# EAGLE design LEDs (EAGLE 9.5.2)
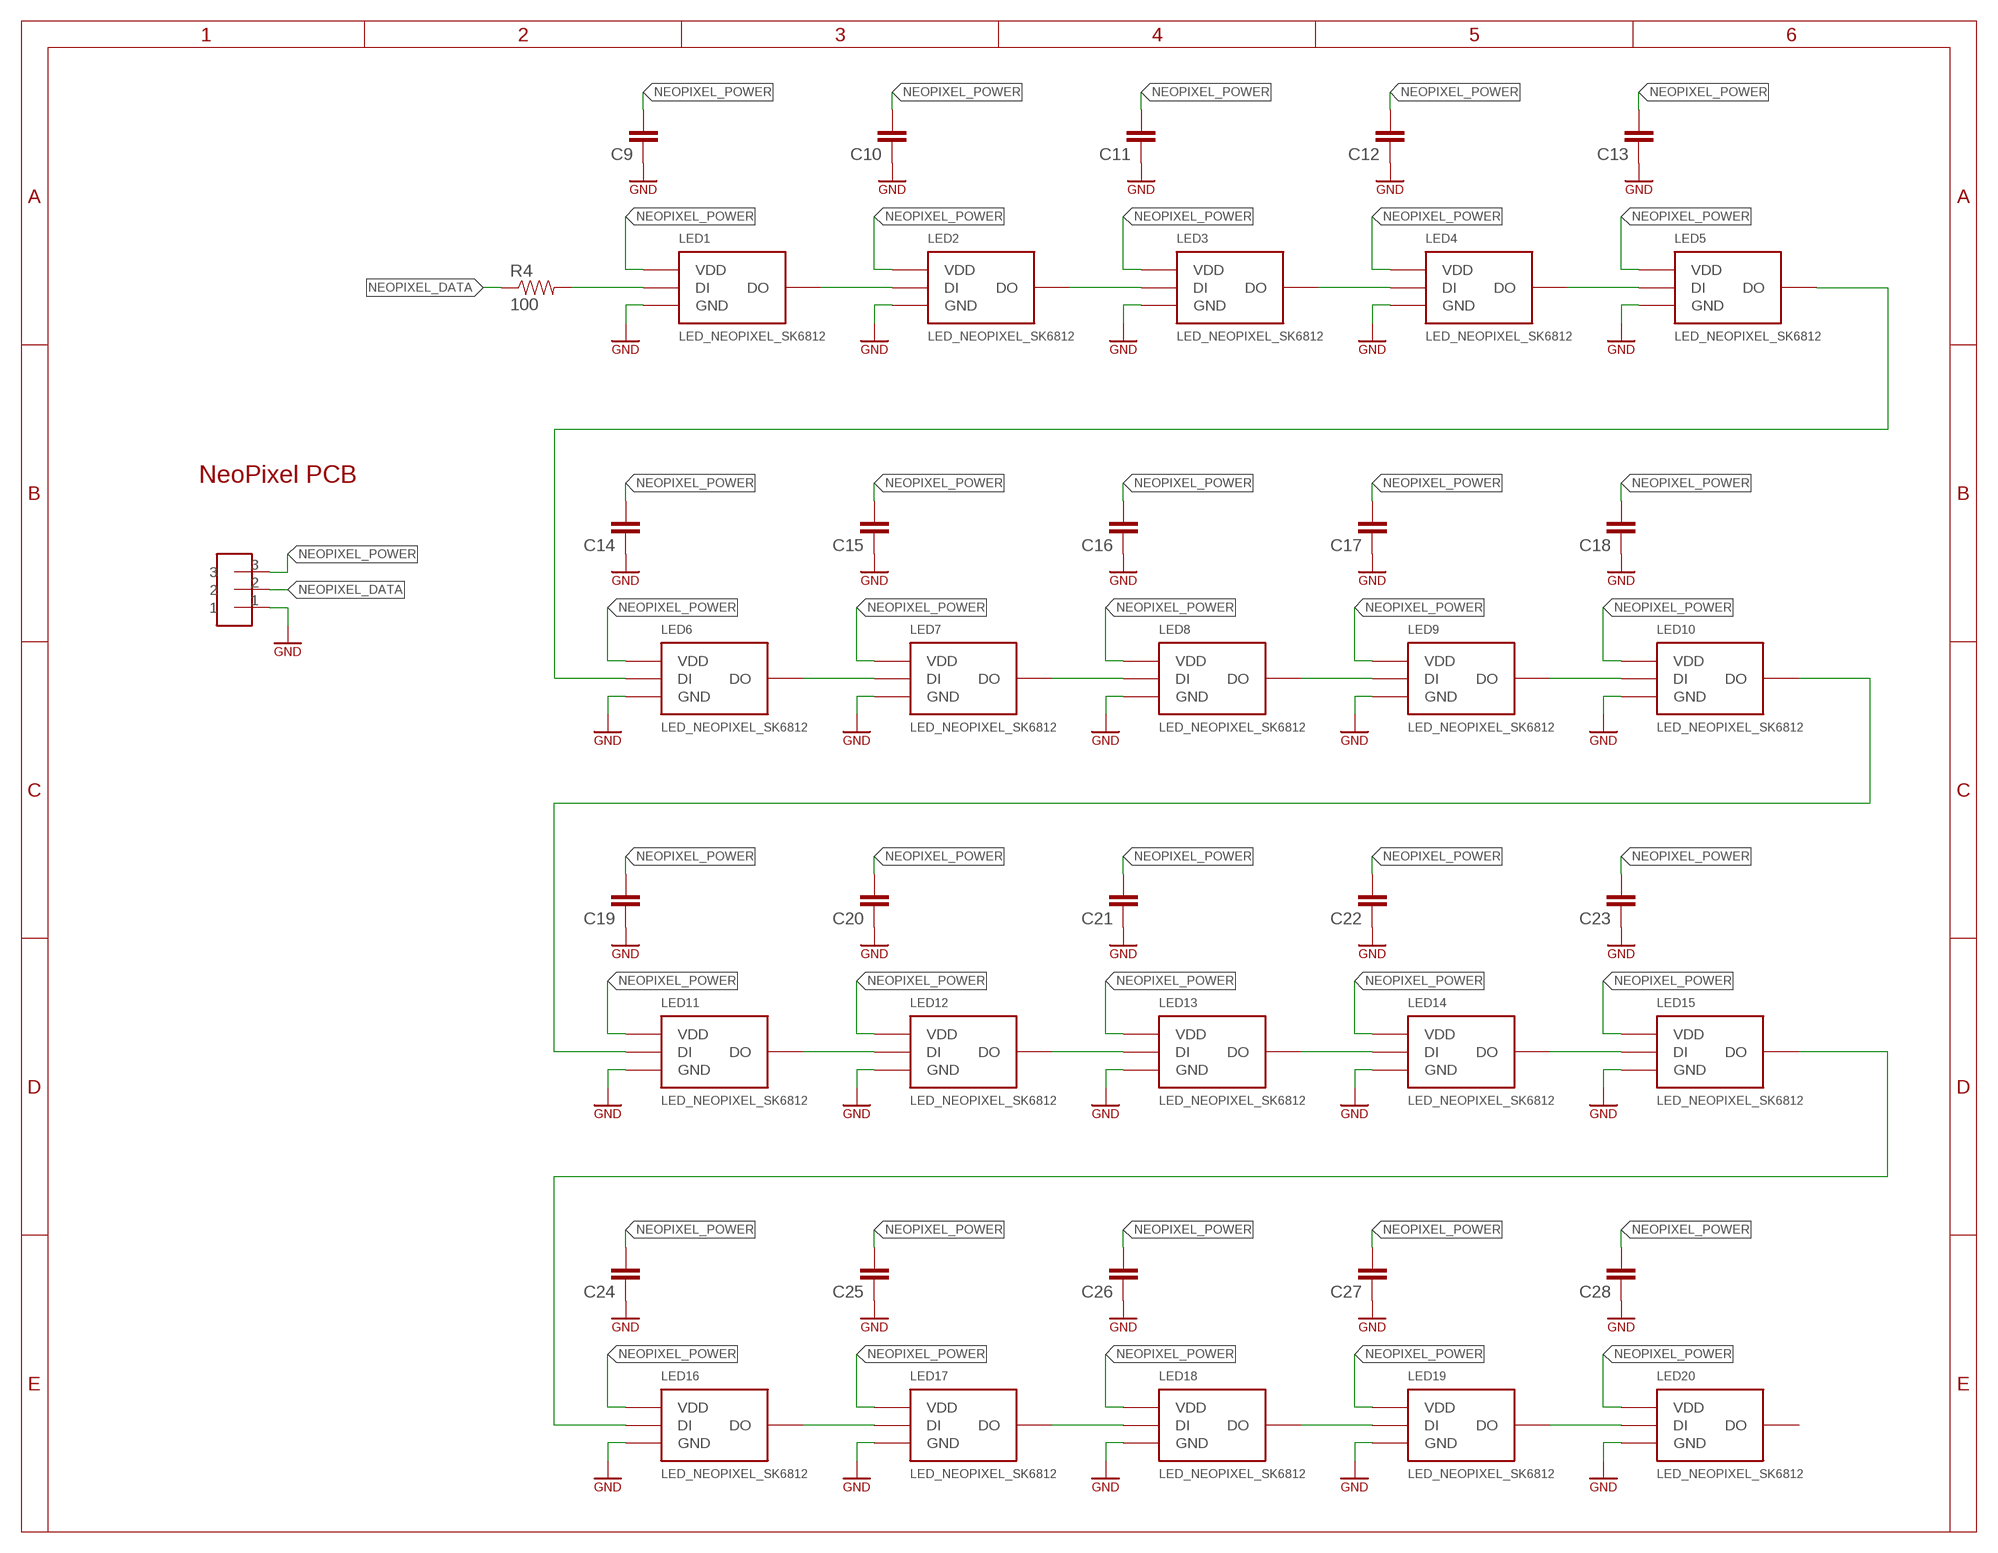
[diagram p0: schematic, sheet 1]

## Parts
C9  COMPONENT_CAP-0805  [0805]
C10  COMPONENT_CAP-0805  [0805]
C11  COMPONENT_CAP-0805  [0805]
C12  COMPONENT_CAP-0805  [0805]
C13  COMPONENT_CAP-0805  [0805]
C14  COMPONENT_CAP-0805  [0805]
C15  COMPONENT_CAP-0805  [0805]
C16  COMPONENT_CAP-0805  [0805]
C17  COMPONENT_CAP-0805  [0805]
C18  COMPONENT_CAP-0805  [0805]
C19  COMPONENT_CAP-0805  [0805]
C20  COMPONENT_CAP-0805  [0805]
C21  COMPONENT_CAP-0805  [0805]
C22  COMPONENT_CAP-0805  [0805]
C23  COMPONENT_CAP-0805  [0805]
C24  COMPONENT_CAP-0805  [0805]
C25  COMPONENT_CAP-0805  [0805]
C26  COMPONENT_CAP-0805  [0805]
C27  COMPONENT_CAP-0805  [0805]
C28  COMPONENT_CAP-0805  [0805]
LED1  LED_NEOPIXEL_SK6812  [SK6812]
LED2  LED_NEOPIXEL_SK6812  [SK6812]
LED3  LED_NEOPIXEL_SK6812  [SK6812]
LED4  LED_NEOPIXEL_SK6812  [SK6812]
LED5  LED_NEOPIXEL_SK6812  [SK6812]
LED6  LED_NEOPIXEL_SK6812  [SK6812]
LED7  LED_NEOPIXEL_SK6812  [SK6812]
LED8  LED_NEOPIXEL_SK6812  [SK6812]
LED9  LED_NEOPIXEL_SK6812  [SK6812]
LED10  LED_NEOPIXEL_SK6812  [SK6812]
LED11  LED_NEOPIXEL_SK6812  [SK6812]
LED12  LED_NEOPIXEL_SK6812  [SK6812]
LED13  LED_NEOPIXEL_SK6812  [SK6812]
LED14  LED_NEOPIXEL_SK6812  [SK6812]
LED15  LED_NEOPIXEL_SK6812  [SK6812]
LED16  LED_NEOPIXEL_SK6812  [SK6812]
LED17  LED_NEOPIXEL_SK6812  [SK6812]
LED18  LED_NEOPIXEL_SK6812  [SK6812]
LED19  LED_NEOPIXEL_SK6812  [SK6812]
LED20  LED_NEOPIXEL_SK6812  [SK6812]
R4  100  COMPONENT_RESISTOR-0805  [0805]
U$2  HEADER-3-HORIZONTAL  [HEADER-3-HORIZONTAL]

## Nets
GND: C9.1 C10.1 C11.1 C12.1 C13.1 C14.1 C15.1 C16.1 C17.1 C18.1 C19.1 C20.1 C21.1 C22.1 C23.1 C24.1 C25.1 C26.1 C27.1 C28.1 LED1.3-GND(GND) LED2.3-GND(GND) LED3.3-GND(GND) LED4.3-GND(GND) LED5.3-GND(GND) LED6.3-GND(GND) LED7.3-GND(GND) LED8.3-GND(GND) LED9.3-GND(GND) LED10.3-GND(GND) LED11.3-GND(GND) LED12.3-GND(GND) LED13.3-GND(GND) LED14.3-GND(GND) LED15.3-GND(GND) LED16.3-GND(GND) LED17.3-GND(GND) LED18.3-GND(GND) LED19.3-GND(GND) LED20.3-GND(GND) U$2.1 ; supply symbol labelled SYMBOL_GND
N$3: LED1.4-DIN(DI) R4.2
N$4: LED1.2-DOUT(DO) LED2.4-DIN(DI)
N$5: LED2.2-DOUT(DO) LED3.4-DIN(DI)
N$6: LED3.2-DOUT(DO) LED4.4-DIN(DI)
N$7: LED4.2-DOUT(DO) LED5.4-DIN(DI)
N$8: LED5.2-DOUT(DO) LED6.4-DIN(DI)
N$9: LED6.2-DOUT(DO) LED7.4-DIN(DI)
N$10: LED7.2-DOUT(DO) LED8.4-DIN(DI)
N$11: LED8.2-DOUT(DO) LED9.4-DIN(DI)
N$12: LED9.2-DOUT(DO) LED10.4-DIN(DI)
N$13: LED10.2-DOUT(DO) LED11.4-DIN(DI)
N$14: LED11.2-DOUT(DO) LED12.4-DIN(DI)
N$15: LED12.2-DOUT(DO) LED13.4-DIN(DI)
N$16: LED13.2-DOUT(DO) LED14.4-DIN(DI)
N$17: LED14.2-DOUT(DO) LED15.4-DIN(DI)
N$18: LED15.2-DOUT(DO) LED16.4-DIN(DI)
N$19: LED16.2-DOUT(DO) LED17.4-DIN(DI)
N$20: LED17.2-DOUT(DO) LED18.4-DIN(DI)
N$21: LED18.2-DOUT(DO) LED19.4-DIN(DI)
N$22: LED19.2-DOUT(DO) LED20.4-DIN(DI)
NEOPIXEL_DATA: R4.1 U$2.2
NEOPIXEL_POWER: C9.2 C10.2 C11.2 C12.2 C13.2 C14.2 C15.2 C16.2 C17.2 C18.2 C19.2 C20.2 C21.2 C22.2 C23.2 C24.2 C25.2 C26.2 C27.2 C28.2 LED1.1-VDD(VDD) LED2.1-VDD(VDD) LED3.1-VDD(VDD) LED4.1-VDD(VDD) LED5.1-VDD(VDD) LED6.1-VDD(VDD) LED7.1-VDD(VDD) LED8.1-VDD(VDD) LED9.1-VDD(VDD) LED10.1-VDD(VDD) LED11.1-VDD(VDD) LED12.1-VDD(VDD) LED13.1-VDD(VDD) LED14.1-VDD(VDD) LED15.1-VDD(VDD) LED16.1-VDD(VDD) LED17.1-VDD(VDD) LED18.1-VDD(VDD) LED19.1-VDD(VDD) LED20.1-VDD(VDD) U$2.3
Unconnected: LED20.2-DOUT(DO)

## Notes on the sheet
- NeoPixel PCB

## Library data of the parts
C9-C28 = homemade-hardware:COMPONENT_CAP: Capacitor Standard 0603 ceramic capacitor, and 0.1" leaded capacitor.
LED1-LED20 = homemade-hardware:LED_NEOPIXEL_SK6812: SK6812 <https://www.digikey.com/product-detail/en/adafruit-industries-llc/1655/1528-1104-ND/5154679>: NeoPixel Addressable LED
R4 = homemade-hardware:COMPONENT_RESISTOR
U$2 = homemade-hardware:HEADER-3: NPTC081KFXC-RC <https://www.digikey.com/product-detail/en/sullins-connector-solutions/NPTC081KFXC-RC/S5600-ND/776058>: Vertical Female SMD Headers TSM-110-01-T-SV <https://www.digikey.com/product-detail/en/samtec-inc/TSM-110-01-T-SV/SAM12267-ND/6691889>: Vertical Male SMD Headers M20-8890845 <https://www.digikey.com/products/en?keywords=952-3236-ND>: Horizontal Male SMD Headers M20-7910842R <https://www.digikey.com/product-detail/en/harwin-inc/M20-7910842R/952-3200-6-ND/6559341>: Horizontal Female SMD Headers

## Board
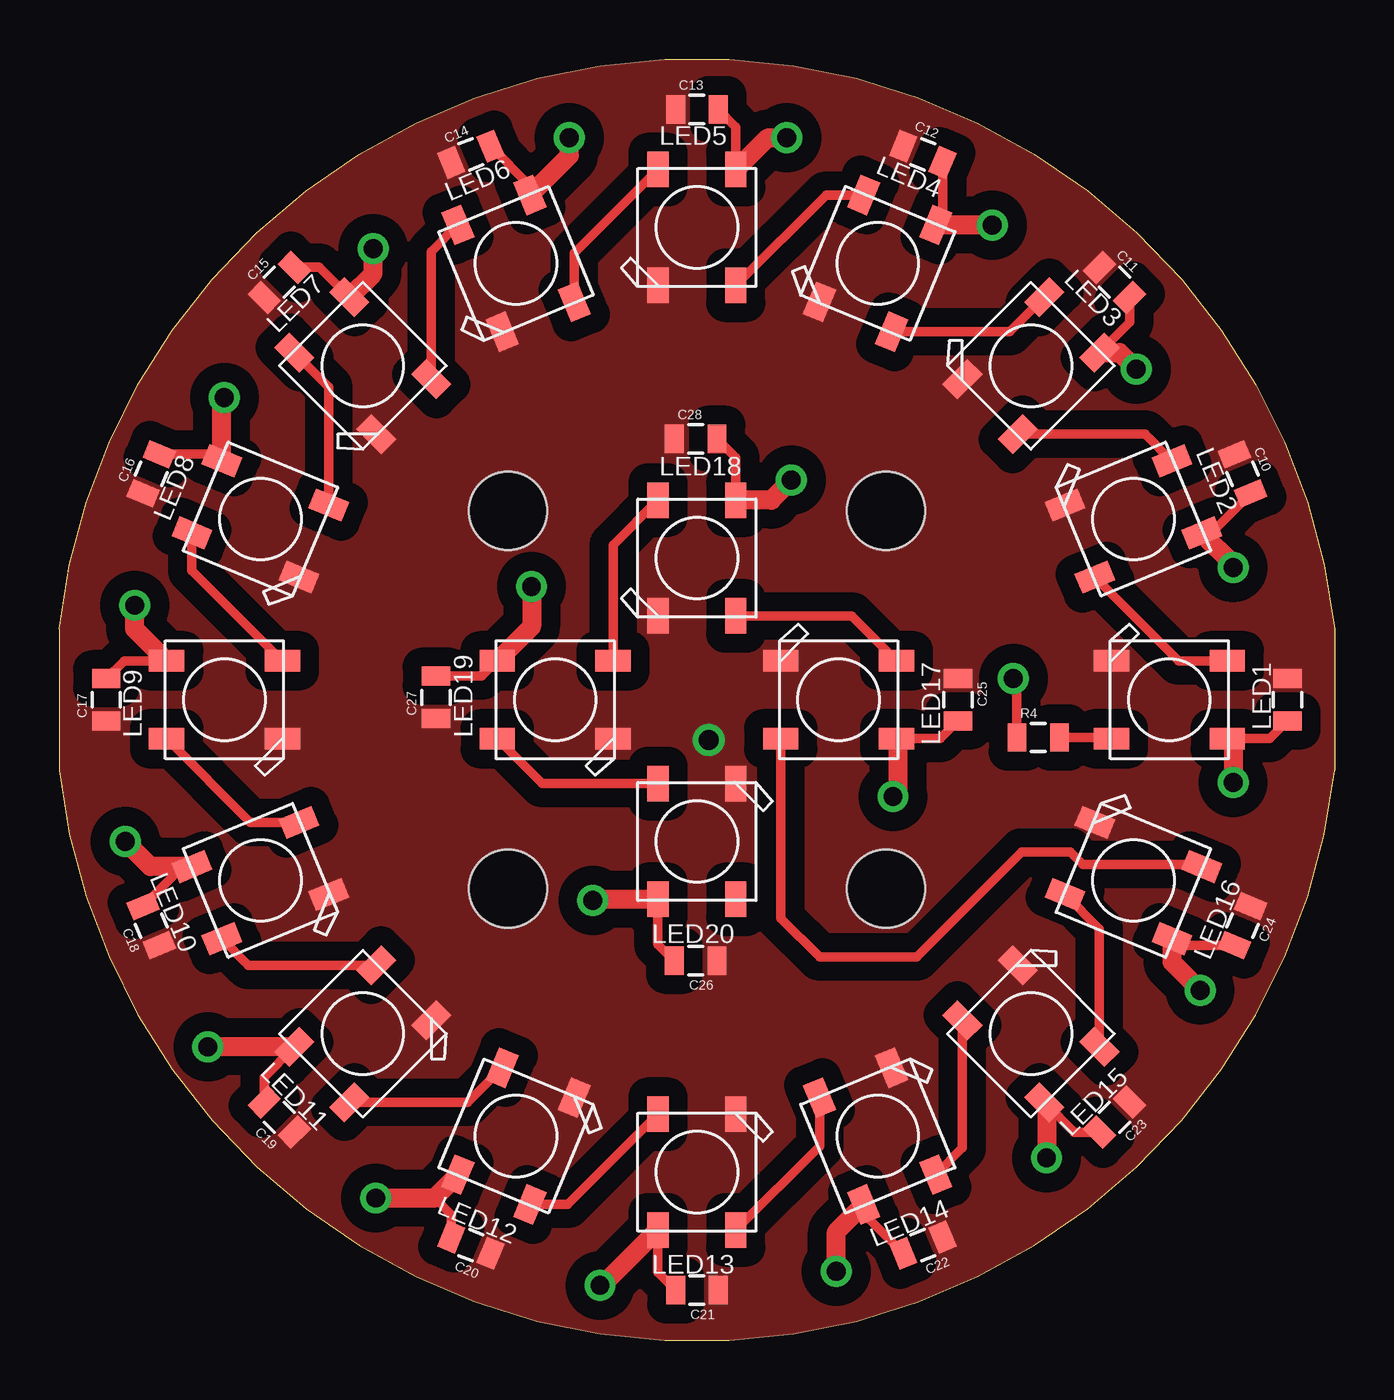
[diagram p1: board, top side]
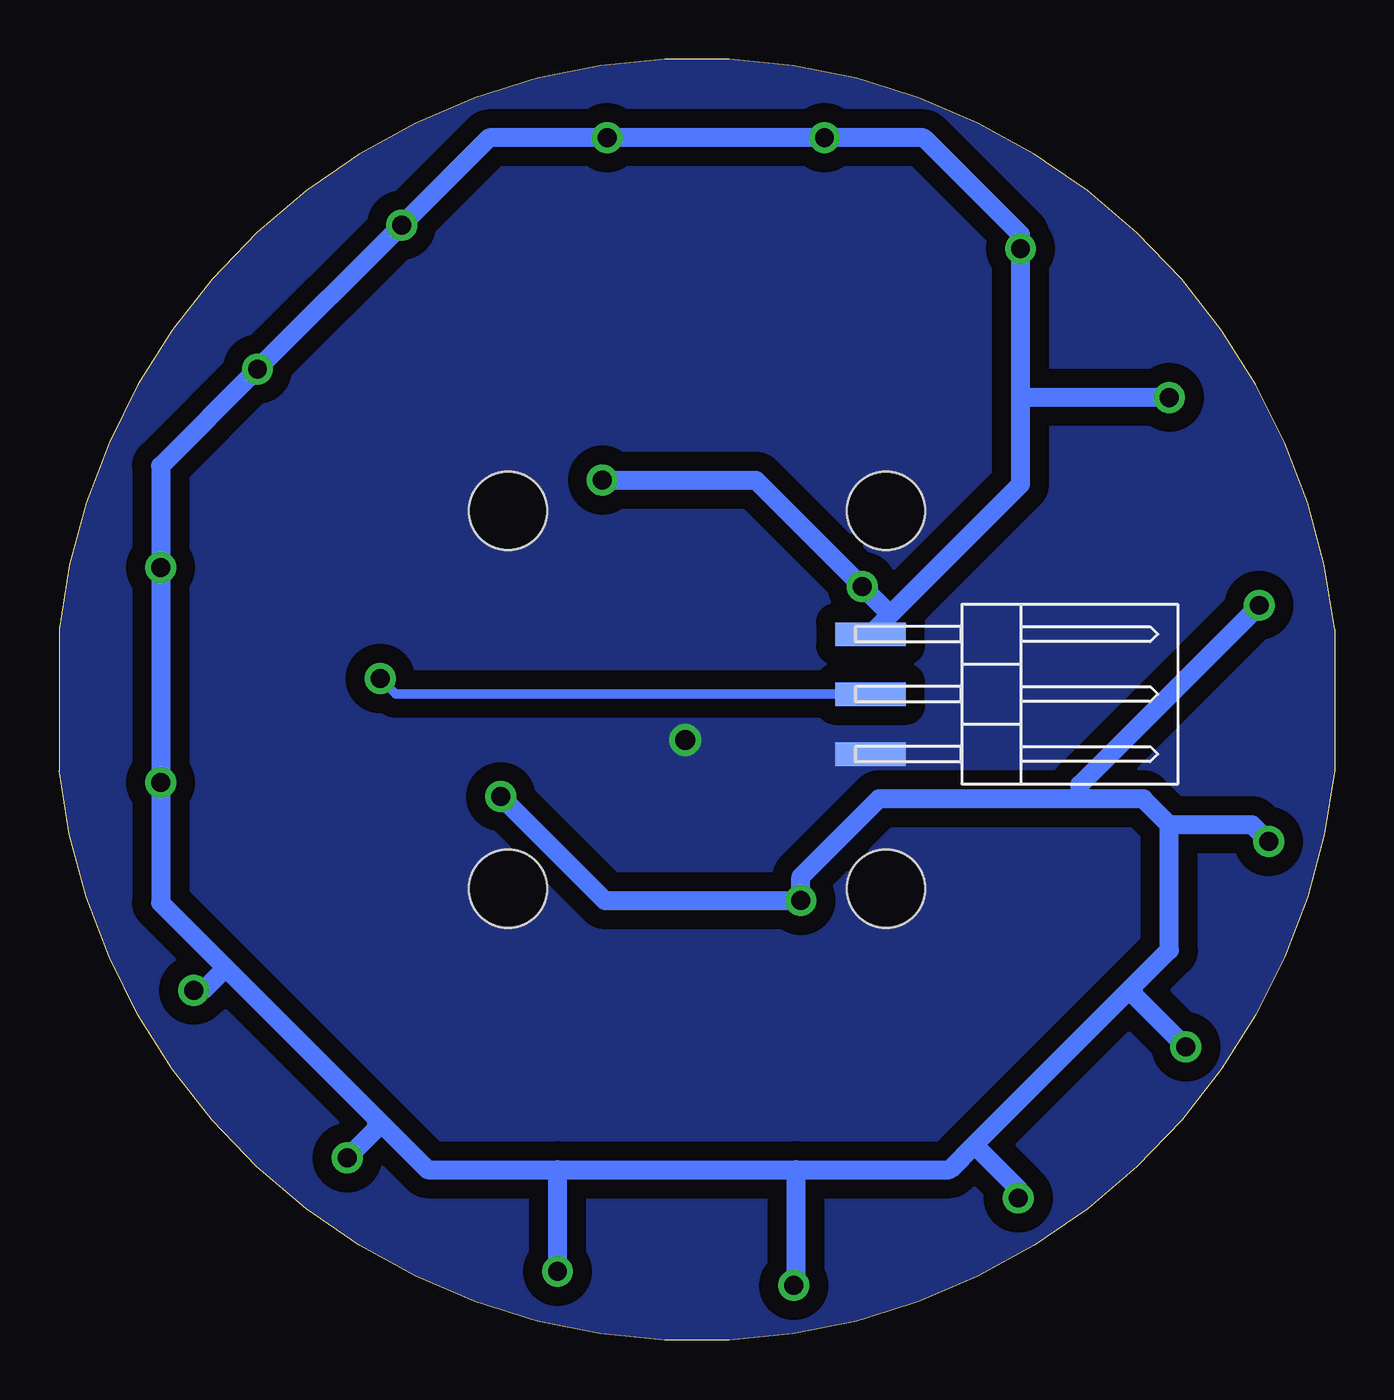
[diagram p2: board, bottom side, seen from below]

Size 54 x 54.26 mm. Coordinates in mm from the lower left corner, seen from the top.
Outline: 0,30.13 arc-167 54,30.13 54,24.13 arc-167 0,24.13 0,30.13
Copper layers (1*16): Top 0.035mm / dielectric 1.5mm / Bottom 0.035mm
Design rules "Endmill-1-32-Bantam": minimum track width 16mil, minimum drill 0.8mm, track to track 0.8mm, track to pad 0.8mm, pad to pad 0.8mm, via to via 0.8mm, smd to smd 0mil, copper to edge 1mil, drill to drill 1mil, minimum pad ring 10mil, minimum via ring 10mil, stop-mask expansion 1mil, vias tented up to drill 30mil, thermal gap 10mil
Holes 3.3 mm at 35,35.13 19,35.13 19,19.13 35,19.13

### Footprints (pad centres in the part's own frame; a part is rotated, then mirrored left to right if it is on the bottom)
0805 = smd 0.8 x 1.2: 1 -0.9,0; 2 0.9,0
SK6812 = smd 1.5 x 0.9: 1-VDD 2.45,-1.65; 2-DOUT 2.45,1.65; 3-GND -2.45,1.65; 4-DIN -2.45,-1.65
HEADER-3-HORIZONTAL = smd 3 x 1: 1 0,0; 2 0,2.54; 3 0,5.08

### Placement (x,y rotation side)
C9  52,27.13 270 top
C10  50.1,36.7 292.5 top
C11  44.68,44.81 315 top
C12  36.57,50.23 337.5 top
C13  27,52.13 0 top
C14  17.43,50.23 22.5 top
C15  9.32,44.81 45 top
C16  3.9,36.7 67.5 top
C17  2,27.13 90 top
C18  3.9,17.56 112.5 top
C19  9.32,9.45 135 top
C20  17.43,4.03 157.5 top
C21  27,2.13 180 top
C22  36.57,4.03 202.5 top
C23  44.68,9.45 225 top
C24  50.1,17.56 247.5 top
C25  38.05,27.13 270 top
C26  26.95,16.08 180 top
C27  15.95,27.23 90 top
C28  26.95,38.18 0 top
LED1  47,27.13 0 top
LED2  45.48,34.79 22.5 top
LED3  41.14,41.27 45 top
LED4  34.65,45.61 67.5 top
LED5  27,47.13 90 top
LED6  19.35,45.61 112.5 top
LED7  12.86,41.27 135 top
LED8  8.52,34.79 157.5 top
LED9  7,27.13 180 top
LED10  8.52,19.48 202.5 top
LED11  12.86,12.99 225 top
LED12  19.35,8.65 247.5 top
LED13  27,7.13 270 top
LED14  34.65,8.65 292.5 top
LED15  41.14,12.99 315 top
LED16  45.48,19.48 337.5 top
LED17  33,27.13 0 top
LED18  27,33.13 90 top
LED19  21,27.13 180 top
LED20  27,21.13 270 top
R4  41.45,25.53 0 top
U$2  19.65,24.83 0 bottom

### Tracks (layer width: path | path; a pad name or v marks a point on that pad's centre or on a via)
GND  (via drill 0.85)
  other vias: 27.5,25.43
  pour Top (no thermals): -1,57.13 55,57.13 55,-0.87 -1,-0.87
  pour Bottom (no thermals): -3,59.13 57,59.13 57,-2.87 -3,-2.87
N$3
  Top 0.406: R4.2 44.5,25.53 LED1.4-DIN
N$4
  Top 0.406: LED1.2-DOUT 47.39,28.78 LED2.4-DIN
N$5
  Top 0.406: LED3.4-DIN 45.98,38.37 LED2.2-DOUT
N$6
  Top 0.406: LED4.4-DIN 40.25,42.71 LED3.2-DOUT
N$7
  Top 0.406: LED5.4-DIN 32.47,48.5 LED4.2-DOUT
N$8
  Top 0.406: LED6.4-DIN 21.81,46.04 LED5.2-DOUT
N$9
  Top 0.406: LED7.4-DIN 15.76,46.11 LED6.2-DOUT
N$10
  Top 0.406: LED8.4-DIN 11.42,40.38 LED7.2-DOUT
N$11
  Top 0.406: LED8.2-DOUT 5.63,32.6 LED9.4-DIN
N$12
  Top 0.406: LED9.2-DOUT 8.09,21.94 LED10.4-DIN
N$13
  Top 0.406: LED10.2-DOUT 8.02,15.89 LED11.4-DIN
N$14
  Top 0.406: LED11.2-DOUT 17.3,10.09 LED12.4-DIN
N$15
  Top 0.406: LED12.2-DOUT 21.53,5.76 LED13.4-DIN
N$16
  Top 0.406: LED13.2-DOUT 32.19,8.22 LED14.4-DIN
N$17
  Top 0.406: LED14.2-DOUT 38.24,8.15 LED15.4-DIN
N$18
  Top 0.406: LED15.2-DOUT 44.04,17.43 LED16.4-DIN
N$19
  Top 0.406: LED16.2-DOUT 48.29,20.15 43.34,20.15 42.81,20.68 40.75,20.68 36.3,16.23 32.2,16.23 30.55,17.88 LED17.4-DIN
N$20
  Top 0.406: LED17.2-DOUT 33.55,30.68 LED18.4-DIN
N$21
  Top 0.406: LED18.2-DOUT 23.45,33.68 LED19.4-DIN
N$22
  Top 0.406: LED19.2-DOUT 20.45,23.58 LED20.4-DIN
NEOPIXEL_DATA  (via drill 0.8)
  Top 0.406: v40.4,28.03 40.55,27.88 R4.1
  Bottom 0.406: v40.4,28.03 39.74,27.37 U$2.2
NEOPIXEL_POWER  (via drill 0.8)
  Top 0.406: C14.2 19.93,48.9 LED6.1-VDD | C13.2 28.65,51.38 LED5.1-VDD | C12.2 37.4,47.52 LED4.1-VDD | C11.2 45.31,43.11 LED3.1-VDD | C10.2 48.77,34.2 LED2.1-VDD | C9.2 51.25,25.48 LED1.1-VDD | C24.2 47.39,16.73 LED16.1-VDD | C21.2 25.35,2.88 LED13.1-VDD | C19.2 8.69,11.15 LED11.1-VDD | C18.2 5.23,20.06 LED10.1-VDD | C17.2 2.75,28.78 LED9.1-VDD | C16.2 6.61,37.53 LED8.1-VDD | C15.2 11.02,45.45 LED7.1-VDD | C27.2 17.9,28.13 LED19.1-VDD | C26.2 25.35,16.78 LED20.1-VDD | LED17.1-VDD 37.3,25.48 C25.2 | LED18.1-VDD 28.65,37.38 C28.2 | C23.2 42.98,8.82 41.8,10 | C20.2 16.6,5.32 15.89,6.03 | C22.2 34.07,5.36 LED14.1-VDD
  Top 0.813: v31,36.43 30.15,35.58 LED18.1-VDD | LED17.1-VDD 35.5,25.43 35.5,23.23 v35.3,23.03 | LED20.1-VDD 22.65,18.68 v22.6,18.63 | LED19.1-VDD 20,30.23 v20,31.93 | LED8.1-VDD 6.89,39.82 v7,39.93 | LED7.1-VDD 13.3,45.18 v13.3,46.23 | LED6.1-VDD 21.6,50.17 v21.6,50.93 | LED5.1-VDD 30,50.93 v30.8,50.93 | LED4.1-VDD v39.49,47.24 v39.5,47.23 | LED3.1-VDD 44.89,41.84 v45.6,41.13 | LED2.1-VDD 49.7,32.87 v49.7,32.73 | LED1.1-VDD 49.7,25.23 v49.7,23.63 | LED16.1-VDD 47.11,16.02 v48.3,14.83 | LED15.1-VDD 41.8,10 v41.8,7.73 | v32.9,2.93 32.9,4.59 LED14.1-VDD | LED13.1-VDD 23,2.33 v22.9,2.33 | LED11.1-VDD v6.31,12.42 v6.3,12.43 | LED10.1-VDD 3.87,20.06 v2.8,21.13 | LED9.1-VDD 3.2,30.13 v3.2,31.13 | LED12.1-VDD 15.89,6.03 v13.4,6.03 | LED14.1-VDD
  Bottom 0.813: U$2.3 18.71,30.85 | 18.71,30.85 13.3,36.26 13.3,39.93 | 13.3,39.93 v13.3,46.23 13.3,46.83 17.4,50.93 v21.6,50.93 v30.8,50.93 35.8,50.93 v39.5,47.23 v45.6,41.13 49.7,37.03 v49.7,32.73 v49.7,23.63 49.7,18.53 46.95,15.78 | 46.95,15.78 40.55,9.38 | 40.55,9.38 38.4,7.23 32.9,7.23 | 32.9,7.23 22.8,7.23 | 22.8,7.23 16.3,7.23 15.25,8.28 | 8.5,15.03 7,16.53 7,21.83 | 8.5,15.03 15.25,8.28 | 7,21.83 8.1,22.93 10.8,22.93 | 10.8,22.93 19.3,22.93 22.6,19.63 v22.6,18.63 30.9,18.63 v35.3,23.03 | 18.71,30.85 18.91,30.85 v20,31.93 24.5,36.43 v31,36.43 | v7,39.93 13.3,39.93 | v48.3,14.83 47.9,14.83 46.95,15.78 | v41.8,7.73 40.55,8.98 40.55,9.38 | v32.9,2.93 32.9,7.23 | v22.9,2.33 22.8,2.43 22.8,7.23 | v13.4,6.03 13.4,6.43 15.25,8.28 | v6.3,12.43 8.5,14.63 8.5,15.03 | v2.8,21.13 3.5,21.83 7,21.83 | v3.2,31.13 10.8,23.53 10.8,22.93